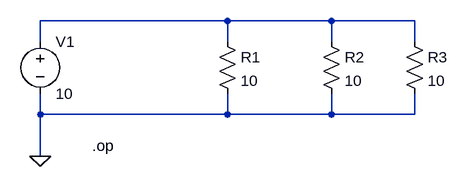
[diagram p0: schematic Parallel circuit.asc]
Parallel circuit.asc, the LTspice schematic file:
Version 4
SHEET 1 880 680
WIRE 208 384 -80 384
WIRE 368 384 208 384
WIRE 496 384 368 384
WIRE -80 416 -80 384
WIRE 208 416 208 384
WIRE 368 416 368 384
WIRE 496 416 496 384
WIRE -80 528 -80 496
WIRE 208 528 208 496
WIRE 208 528 -80 528
WIRE 368 528 368 496
WIRE 368 528 208 528
WIRE 496 528 496 496
WIRE 496 528 368 528
WIRE -80 592 -80 528
FLAG -80 592 0
SYMBOL voltage -80 400 R0
SYMATTR InstName V1
SYMATTR Value 10
SYMBOL res 192 400 R0
SYMATTR InstName R1
SYMATTR Value 10
SYMBOL res 352 400 R0
SYMATTR InstName R2
SYMATTR Value 10
SYMBOL res 480 400 R0
SYMATTR InstName R3
SYMATTR Value 10
TEXT 0 576 Left 2 !.op

The netlist it stands for:
* Parallel circuit.asc
V1 N001 0 10
R1 N001 0 10
R2 N001 0 10
R3 N001 0 10
.op
.backanno
.end